# EAGLE design rotometer (EAGLE 7.6.0)
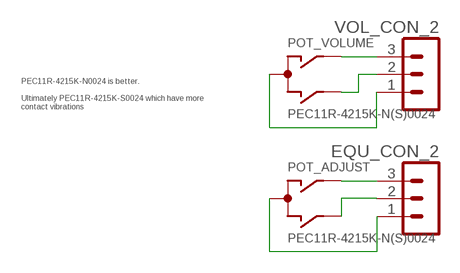
[diagram p0: schematic, sheet 1]

## Parts
EQU_CON_2  MA03-1  [MA03-1]
POT_ADJUST  PEC11R-4215K-N(S)0024  EC12E_SW  [ALPS_EC12E_SW]
POT_VOLUME  PEC11R-4215K-N(S)0024  EC12E_SW  [ALPS_EC12E_SW]
VOL_CON_2  MA03-1  [MA03-1]

## Nets
EQU_GND: EQU_CON_2.1 POT_ADJUST.C
N$8: POT_VOLUME.B VOL_CON_2.2
N$43: POT_VOLUME.A VOL_CON_2.3
N$52: EQU_CON_2.3 POT_ADJUST.A
N$53: EQU_CON_2.2 POT_ADJUST.B
VOL_GND: POT_VOLUME.C VOL_CON_2.1
Unconnected: POT_ADJUST.D POT_ADJUST.E POT_ADJUST.GND1(G) POT_ADJUST.GND2(G) POT_VOLUME.D POT_VOLUME.E POT_VOLUME.GND1(G) POT_VOLUME.GND2(G)

## Notes on the sheet
- PEC11R-4215K-N0024 is better.
  
  Ultimately PEC11R-4215K-S0024 which have more 
  contact vibrations

## Library data of the parts
EQU_CON_2 VOL_CON_2 = con-lstb:MA03-1: PIN HEADER; OC_FARNELL: unknown; OC_NEWARK: unknown
POT_ADJUST POT_VOLUME = switch-alps:EC12E_SW: ALPS rotary Encoder EC12E series with switch; MPN: EC12E2424407; OC_FARNELL: 1520813; OC_NEWARK: 74M1068

## Board
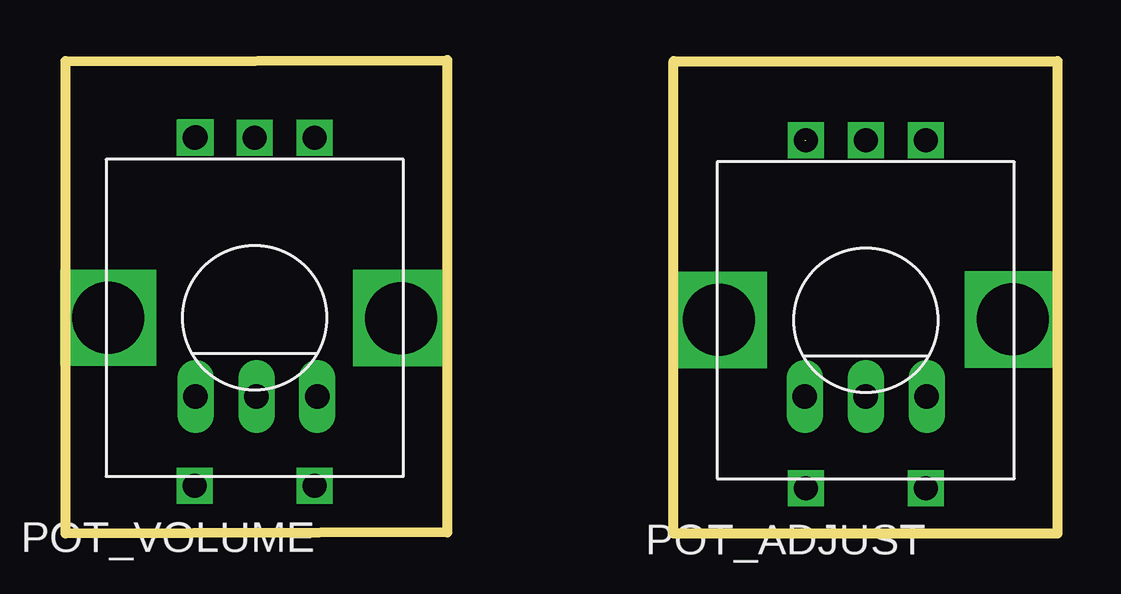
[diagram p1: board, top side]
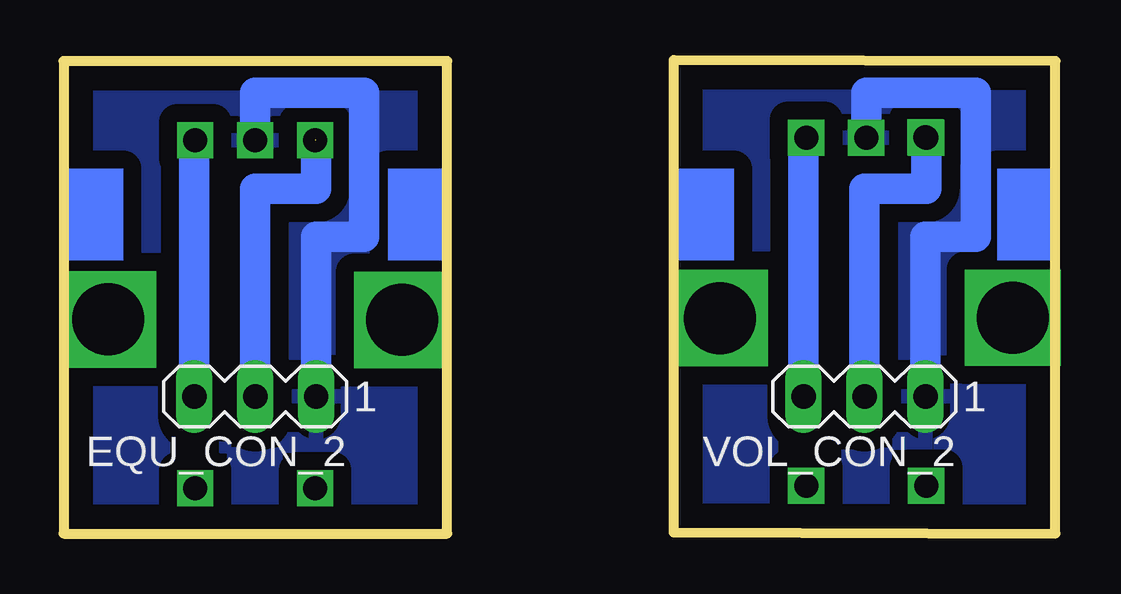
[diagram p2: board, bottom side, seen from below]

Size 41.34 x 19.73 mm. Coordinates in mm from the lower left corner, seen from the top.
Outline: 0,19.69 15.91,19.73 15.91,0.05 0,0 0,19.69
Outline: 25.35,19.69 41.34,19.69 41.34,0 25.35,0 25.35,19.69
Copper layers (1*16): Top 0.035mm / dielectric 1.5mm / Bottom 0.035mm
Design rules "default": minimum track width 10mil, minimum drill 24mil, track to track 8mil, track to pad 8mil, pad to pad 8mil, via to via 8mil, smd to smd 8mil, copper to edge 40mil, drill to drill 8mil, minimum pad ring 10mil, minimum via ring 8mil, stop-mask expansion 4mil, vias tented up to drill 0mil, thermal gap 10mil

### Footprints (pad centres in the part's own frame; a part is rotated, then mirrored left to right if it is on the bottom)
MA03-1 = drill 1.016 long: 1 -2.54,0; 2 0,0; 3 2.54,0
ALPS_EC12E_SW = drill 1 square: A -2.5,-7.5; B 2.5,-7.5; C 0,-7.5; D -2.5,7; E 2.5,7 | drill 2.6 square: GND1 -6.1,0; GND2 6.1,0

### Placement (x,y rotation side)
EQU_CON_2  33.36,5.72 180 bottom
POT_ADJUST  33.36,8.89 180 top
POT_VOLUME  7.89,8.99 180 top
VOL_CON_2  7.95,5.72 180 bottom

### Tracks (layer width: path | path; a pad name or v marks a point on that pad's centre or on a via)
EQU_GND
  Bottom 1.27: POT_ADJUST.C 33.36,18.37 28.83,18.37 28.83,12.37 30.81,12.37 EQU_CON_2.1
  pour Bottom (isolate 0.762): 24.8,19.69 41.89,19.73 41.89,0.05 24.8,0
N$1  (via drill 3)
  other vias: 39.48,8.93
N$2  (via drill 1)
  other vias: 5.42,16.51
N$3  (via drill 3)
  other vias: 13.98,8.98
N$4  (via drill 3)
  other vias: 27.23,8.91
N$5  (via drill 3)
  other vias: 1.78,9
N$8
  Bottom 1.27: POT_VOLUME.B 5.39,14.37 7.95,14.37 VOL_CON_2.2
N$43
  Bottom 1.27: POT_VOLUME.A 10.5,16.49 VOL_CON_2.3
N$52
  Bottom 1.27: POT_ADJUST.A 35.89,16.39 EQU_CON_2.3
N$53  (1 unrouted)
  Bottom 1.27: 30.81,16.39 30.81,14.37 33.36,14.37 EQU_CON_2.2
VOL_GND
  Bottom 1.27: POT_VOLUME.C 7.89,18.37 3.33,18.37 3.33,12.37 5.42,12.37 VOL_CON_2.1
  pour Bottom (isolate 0.762): -0.6,19.69 16.51,19.64 16.51,-0.05 -0.6,0
(copper drawn outside any net)
  shapes: Bottom area x4